# Altium schematic sheet ATMEGA128转换座.SchDoc
size A4
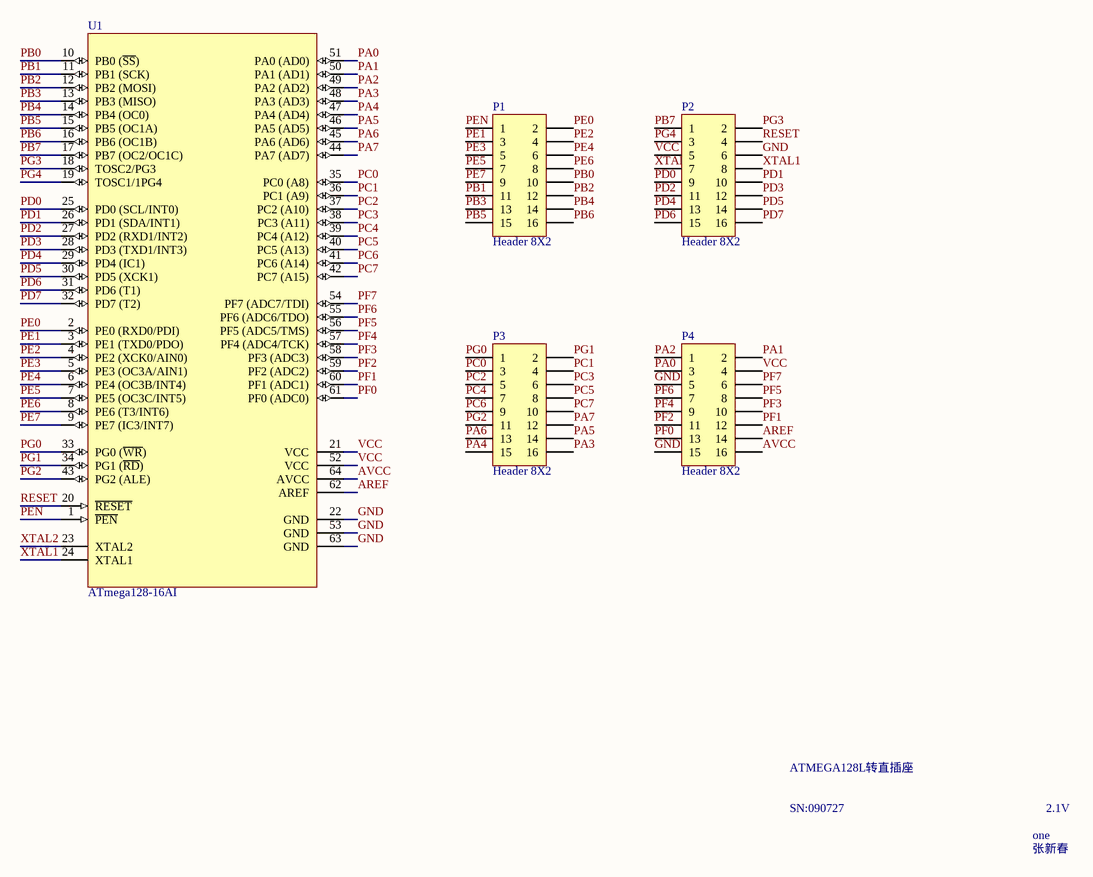
[diagram p0: ATMEGA128转换座.SchDoc]

## Parts
P1  Header 8X2  [HDR2X8]
P2  Header 8X2  [HDR2X8]
P3  Header 8X2  [HDR2X8]
P4  Header 8X2  [HDR2X8]
U1  ATmega128-16AI  [64A]

## Nets
AREF: P4.14 U1.62(AREF)
AVCC: P4.16 U1.64(AVCC)
GND: P2.6 P4.5 P4.15 U1.22(GND) U1.53(GND) U1.63(GND)
PA0: P4.3 U1.51(PA0_(AD0))
PA1: P4.2 U1.50(PA1_(AD1))
PA2: P4.1 U1.49(PA2_(AD2))
PA3: P3.16 U1.48(PA3_(AD3))
PA4: P3.15 U1.47(PA4_(AD4))
PA5: P3.14 U1.46(PA5_(AD5))
PA6: P3.13 U1.45(PA6_(AD6))
PA7: P3.12 U1.44(PA7_(AD7))
PB0: P1.10 U1.10(PB0_(~{SS}))
PB1: P1.11 U1.11(PB1_(SCK))
PB2: P1.12 U1.12(PB2_(MOSI))
PB3: P1.13 U1.13(PB3_(MISO))
PB4: P1.14 U1.14(PB4_(OC0))
PB5: P1.15 U1.15(PB5_(OC1A))
PB6: P1.16 U1.16(PB6_(OC1B))
PB7: P2.1 U1.17(PB7_(OC2/OC1C))
PC0: P3.3 U1.35(PC0_(A8))
PC1: P3.4 U1.36(PC1_(A9))
PC2: P3.5 U1.37(PC2_(A10))
PC3: P3.6 U1.38(PC3_(A11))
PC4: P3.7 U1.39(PC4_(A12))
PC5: P3.8 U1.40(PC5_(A13))
PC6: P3.9 U1.41(PC6_(A14))
PC7: P3.10 U1.42(PC7_(A15))
PD0: P2.9 U1.25(PD0_(SCL/INT0))
PD1: P2.10 U1.26(PD1_(SDA/INT1))
PD2: P2.11 U1.27(PD2_(RXD1/INT2))
PD3: P2.12 U1.28(PD3_(TXD1/INT3))
PD4: P2.13 U1.29(PD4_(IC1))
PD5: P2.14 U1.30(PD5_(XCK1))
PD6: P2.15 U1.31(PD6_(T1))
PD7: P2.16 U1.32(PD7_(T2))
PE0: P1.2 U1.2(PE0_(RXD0/PDI))
PE1: P1.3 U1.3(PE1_(TXD0/PDO))
PE2: P1.4 U1.4(PE2_(XCK0/AIN0))
PE3: P1.5 U1.5(PE3_(OC3A/AIN1))
PE4: P1.6 U1.6(PE4_(OC3B/INT4))
PE5: P1.7 U1.7(PE5_(OC3C/INT5))
PE6: P1.8 U1.8(PE6_(T3/INT6))
PE7: P1.9 U1.9(PE7_(IC3/INT7))
PEN: P1.1 U1.1(~{PEN})
PF0: P4.13 U1.61(PF0_(ADC0))
PF1: P4.12 U1.60(PF1_(ADC1))
PF2: P4.11 U1.59(PF2_(ADC2))
PF3: P4.10 U1.58(PF3_(ADC3))
PF4: P4.9 U1.57(PF4_(ADC4/TCK))
PF5: P4.8 U1.56(PF5_(ADC5/TMS))
PF6: P4.7 U1.55(PF6_(ADC6/TDO))
PF7: P4.6 U1.54(PF7_(ADC7/TDI))
PG0: P3.1 U1.33(PG0_(~{WR}))
PG1: P3.2 U1.34(PG1_(~{RD}))
PG2: P3.11 U1.43(PG2_(ALE))
PG3: P2.2 U1.18(TOSC2/PG3)
PG4: P2.3 U1.19(TOSC1/1PG4)
RESET: P2.4 U1.20(~{RESET})
VCC: P2.5 P4.4 U1.21(VCC) U1.52(VCC)
XTAL1: P2.8 U1.24(XTAL1)
XTAL2: P2.7 U1.23(XTAL2)

## Notes on the sheet
- ATMEGA128L转直插座
- SN:090727
- one
- 2.1V
- 张新春

## Library data of the parts
P1-P4 = Header 8X2: Header, 8-Pin, Dual row; LatestRevisionDate: 17-Jul-2002; LatestRevisionNote: Re-released for DXP Platform.; Publisher: Altium Limited
U1 = ATmega128-16AI: 8-Bit AVR Microcontroller with 128K Bytes of In-System Programmable Flash Memory; PackageDocument: revB, Oct-2001; Published: 17-Sep-2003; LatestRevisionDate: 4-Mar-2005; LatestRevisionNote: Stylized 3D Model Added.; DatasheetDocument: 2467G-AVR-09/02; PackageReference: 64A; Publisher: Altium Limited; Code_JEDEC: MS-026-AEB; ComponentLink1Description: Manufacturer Link; ComponentLink1URL: http://www.atmel.com; ComponentLink2Description: Datasheet; ComponentLink2URL: http://www.atmel.com/dyn/resources/prod_documents/doc2467.pdf